# EAGLE design ZeroGecko110BreakoutV1.1 (EAGLE 6.5.0)
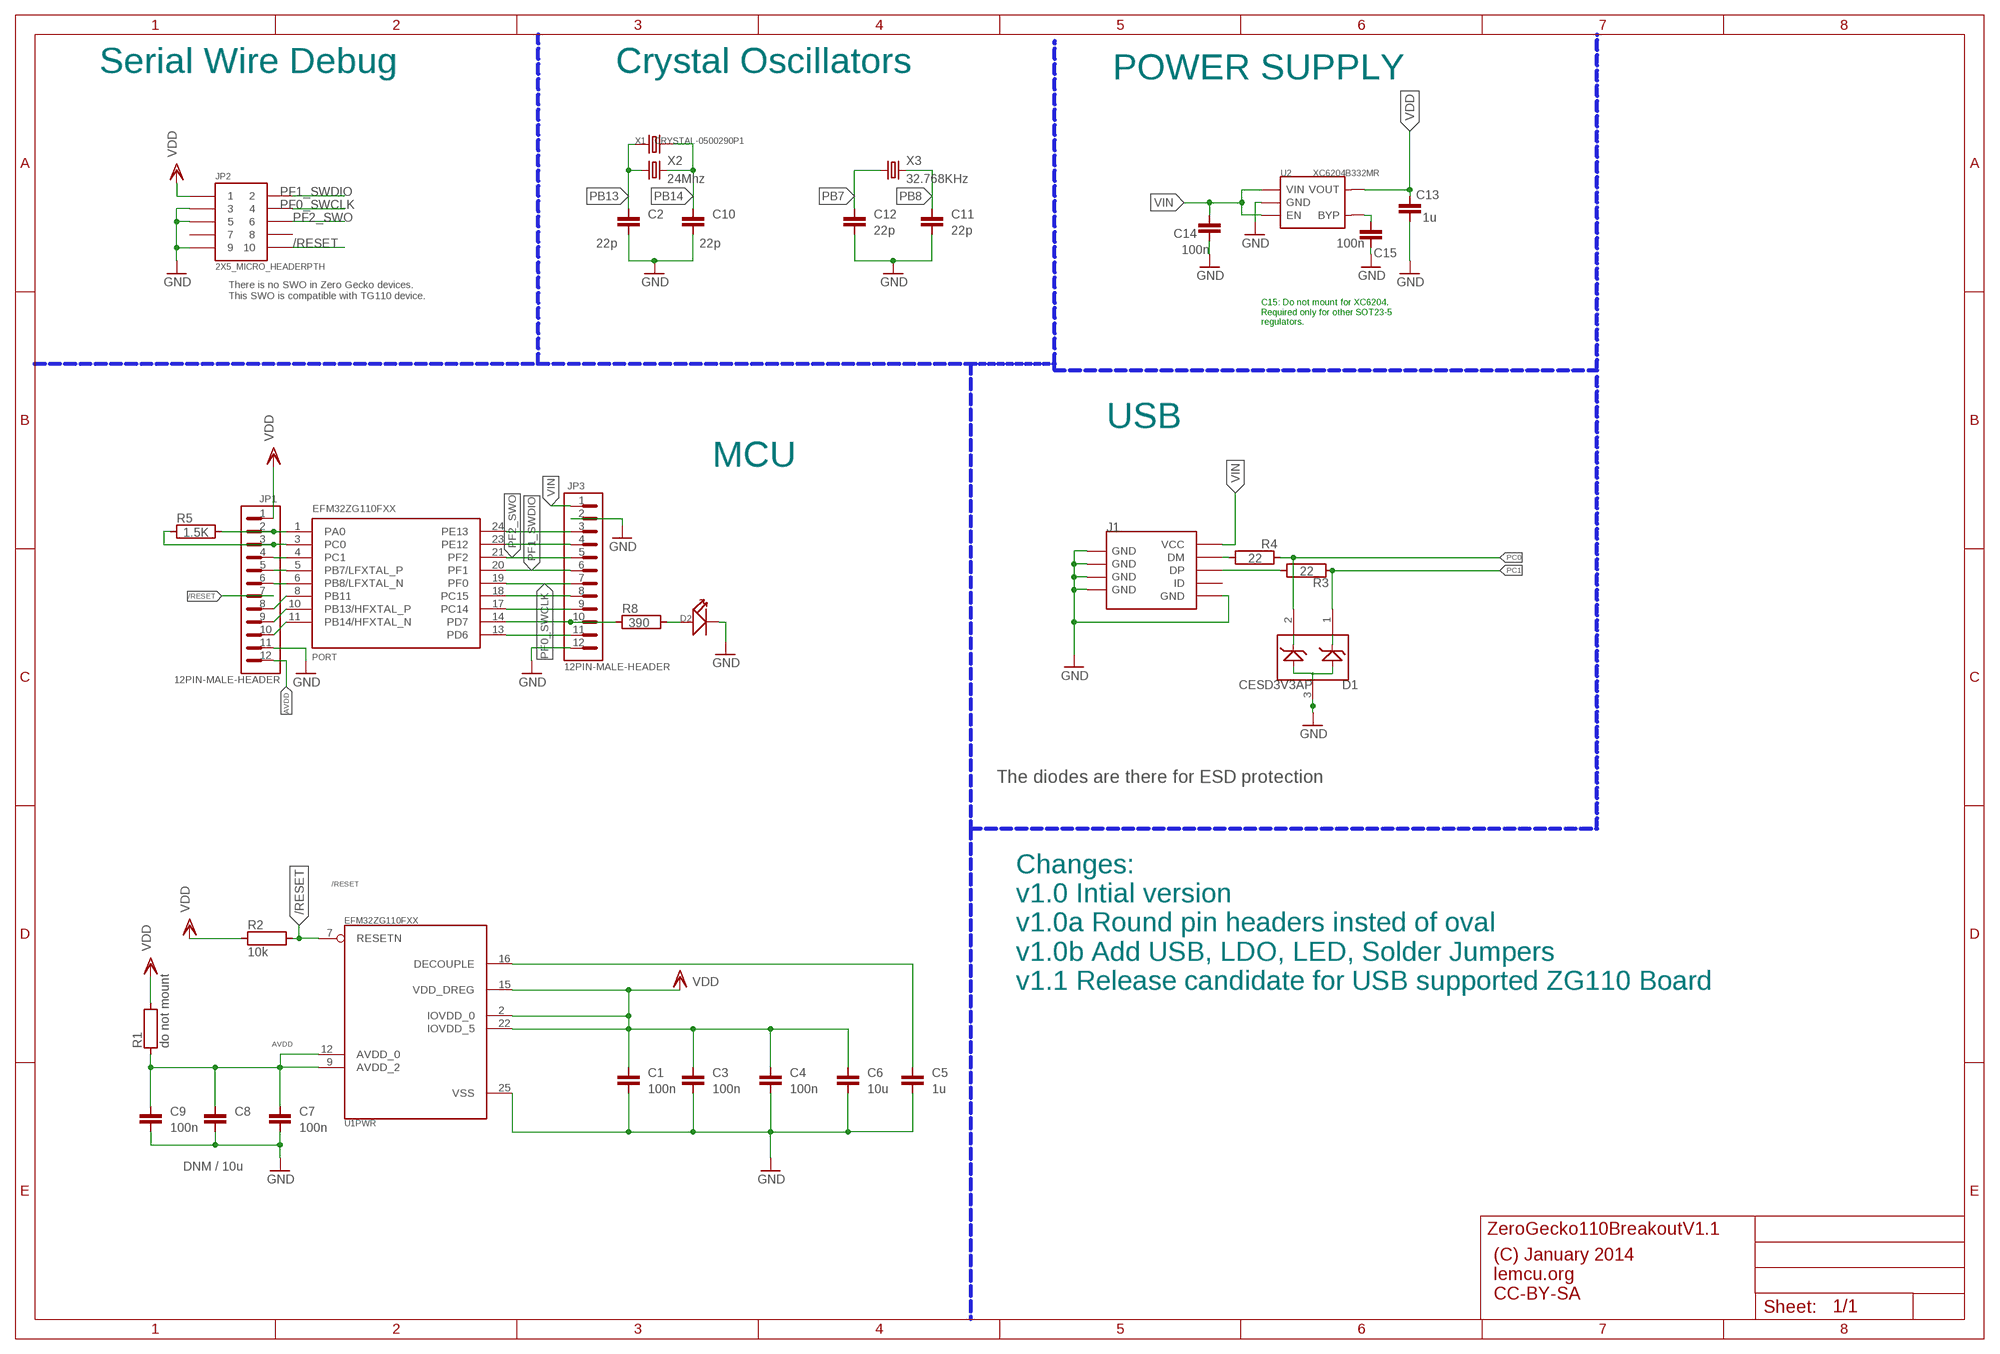
[diagram p0: schematic, sheet 1]

## Parts
C1  100n  C0603  [C0603]
C2  22p  C0603  [C0603]
C3  100n  C0603  [C0603]
C4  100n  C0603  [C0603]
C5  1u  C0805  [C0805]
C6  10u  C0805  [C0805]
C7  100n  C0603  [C0603]
C8  DNM / 10u  C0805  [C0805]
C9  100n  C0603  [C0603]
C10  22p  C0603  [C0603]
C11  22p  C0603  [C0603]
C12  22p  C0603  [C0603]
C13  1u  C0805  [C0805]
C14  100n  C0805  [C0805]
C15  100n  C0805  [C0805]
D1  CESD3V3AP  D-ESD-3P  [SOT23]
D2  LED  [LED0603]
J1  USB-MINIUSB-5P-MICRO  [MICRO-USB]
JP1  12PIN-MALE-HEADER  [12P-2.54MM]
JP2  2X5_MICRO_HEADERPTH  [2X5_1.27MM_PTH]
JP3  12PIN-MALE-HEADER  [12P-2.54MM]
R1  do not mount  R0805  [R0805]
R2  10k  R0603  [R0603]
R3  22  R0603  [R0603]
R4  22  R0603  [R0603]
R5  1.5K  R0603  [R0603]
R8  390  R0603  [R0603]
U1  EFM32ZG110FXX  [QFN24]
U2  XC6204B332MR  [SOT23-5]
X1  CRYSTAL-0500290P1  [2P-SMD-5.0X3.2]
X2  24Mhz  CRYSTALHC49U-V  [HC49U-V]
X3  32.768KHz  CRYSTALTC26V  [TC26V]

## Nets
/RESET: JP1.7 JP2.10 R2.2 U1.7(PWR:RESETN)
AVDD: C7.2 C8.2 C9.2 JP1.12 R1.1 U1.9(PWR:AVDD_2) U1.12(PWR:AVDD_0)
GND: C1.1 C2.1 C3.1 C4.1 C5.1 C6.1 C7.1 C8.1 C9.1 C10.1 C11.1 C12.1 C13.1 C14.1 C15.1 D1.3 D2.- J1.5(GND) J1.S1(GND) J1.S2(GND) J1.S3(GND) J1.S4(GND) J1.S5(GND) J1.S6(GND) JP1.11 JP2.3 JP2.5 JP2.9 JP3.2 JP3.12 U1.25(PWR:VSS) U2.2(GND)
N$1: J1.2(DM) R4.1
N$2: J1.3(DP) R3.1
N$3: D2.+ R8.2
N$4: C15.2 U2.4(BYP)
N$24: C5.2 U1.16(PWR:DECOUPLE)
PA0: JP1.2 R5.2 U1.1(A:PA0)
PB7: C12.2 JP1.5 U1.5(A:PB7/LFXTAL_P) X3.1
PB8: C11.2 JP1.6 U1.6(A:PB8/LFXTAL_N) X3.2
PB11: JP1.8 U1.8(A:PB11)
PB13: C2.2 JP1.9 U1.10(A:PB13/HFXTAL_P) X1.1 X2.1
PB14: C10.2 JP1.10 U1.11(A:PB14/HFXTAL_N) X1.2 X2.2
PC0: D1.2 JP1.3 R4.2 R5.1 U1.3(A:PC0)
PC1: D1.1 JP1.4 R3.2 U1.4(A:PC1)
PC14: JP3.9 U1.17(A:PC14)
PC15: JP3.8 U1.18(A:PC15)
PD6: JP3.11 U1.13(A:PD6)
PD7: JP3.10 R8.1 U1.14(A:PD7)
PE12: JP3.4 U1.23(A:PE12)
PE13: JP3.3 U1.24(A:PE13)
PF0_SWCLK: JP2.4 JP3.7 U1.19(A:PF0)
PF1_SWDIO: JP2.2 JP3.6 U1.20(A:PF1)
PF2_SWO: JP2.6 JP3.5 U1.21(A:PF2)
VDD: C1.2 C3.2 C4.2 C6.2 C13.2 JP1.1 JP2.1 R1.2 R2.1 U1.2(PWR:IOVDD_0) U1.15(PWR:VDD_DREG) U1.22(PWR:IOVDD_5) U2.5(VOUT)
VIN: C14.2 J1.1(VCC) JP3.1 U2.1(VIN) U2.3(EN)
Unconnected: J1.4(ID) JP2.7 JP2.8

## Notes on the sheet
- Serial Wire Debug | Crystal Oscillators | POWER SUPPLY
- There is no SWO in Zero Gecko devices.
  This SWO is compatible with TG110 device.
- C15: Do not mount for XC6204.
  Required only for other SOT23-5
  regulators.
- USB
- MCU
- The diodes are there for ESD protection
- Changes:
  v1.0 Intial version
  v1.0a Round pin headers insted of oval
  v1.0b Add USB, LDO, LED, Solder Jumpers
  v1.1 Release candidate for USB supported ZG110 Board
- (C) January 2014
  lemcu.org
  CC-BY-SA

## Library data of the parts
C1-C15 = klib:C
D1 = Discrete:D-ESD-3P
D2 = OPL Eagle Library:LED*: LED
J1 = Connector :USB-MINIUSB-5P
JP1 JP3 = lemcu_org_connector:12PIN-MALE-HEADER
JP2 = lemcu_org_micro_pin_headers:2X5_MICRO_HEADER: 2x5 1.27mm pitch micro header * 2013 (c) http://lemcu.org * Licensed under CC-BY-SA or CC0
R1-R5 R8 = klib:R
U1 = ZeroGecko:EFM32ZG110FXX: EFM32ZG110FXX Zero Microcontroller in 5mm x 5mm QFN24 package
U2 = OPL Eagle Library:XC6204: The XC6204 series are highly precise, low noise, positive voltage LDO regulators manufactured using CMOS processes
X1 = OPL Eagle Library:CRYSTAL*
X2 X3 = crystal:CRYSTAL: CRYSTAL

## Board
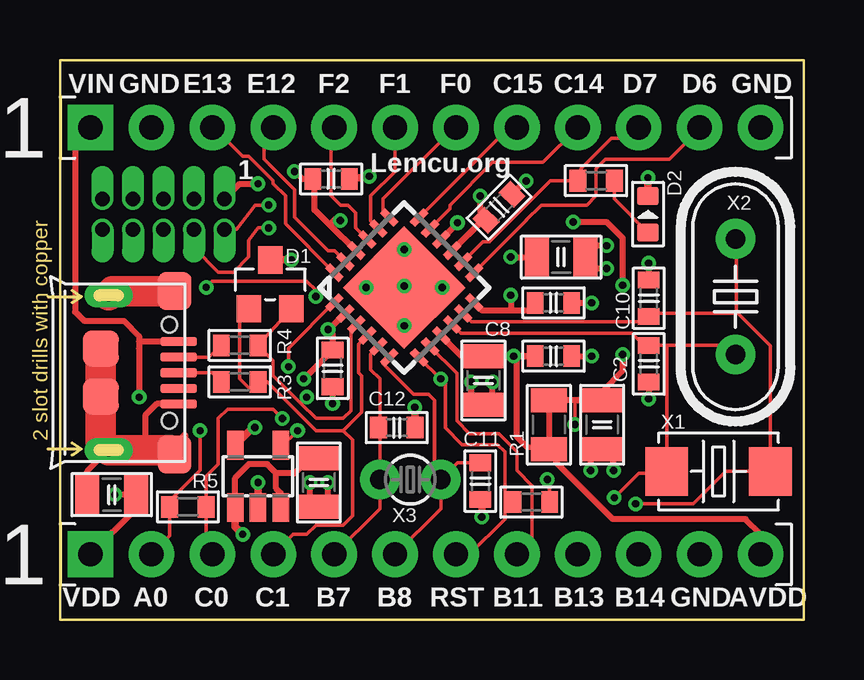
[diagram p1: board, top side]
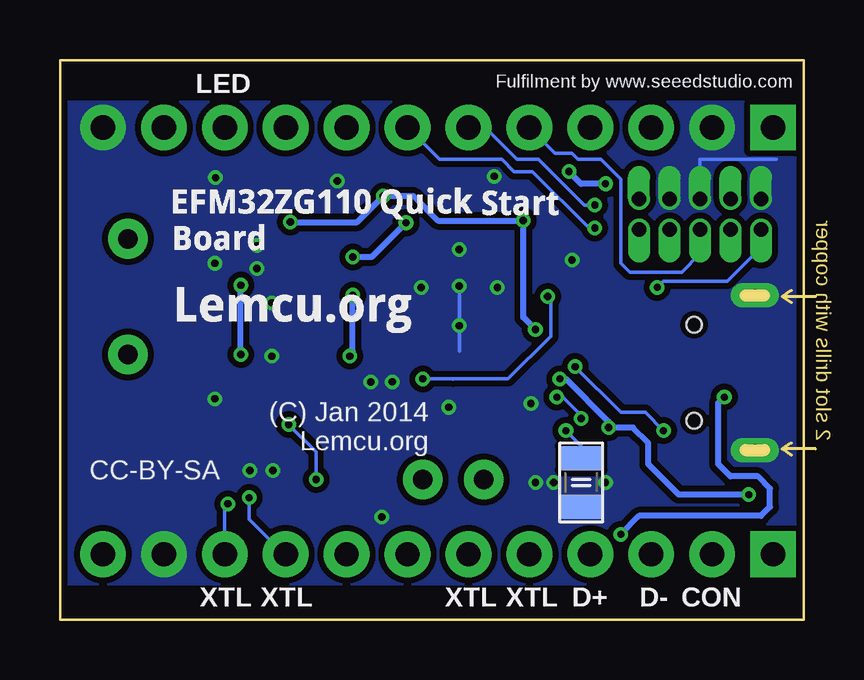
[diagram p2: board, bottom side, seen from below]

Size 31 x 23.32 mm. Coordinates in mm from the lower left corner, seen from the top.
Outline: 0,0 0,23.32 31,23.32 31,0 0,0
Copper layers (1*16): Top 0.035mm / dielectric 0.2mm / Bottom 0.035mm
Design rules: minimum track width 0.149859375mm, minimum drill 12mil, track to track 6mil, track to pad 6mil, pad to pad 6mil, via to via 6mil, smd to smd 0mil, copper to edge 10mil, drill to drill 10mil, minimum pad ring 6mil, minimum via ring 6mil, stop-mask expansion 2mil, vias tented up to drill 25mil, thermal gap 10mil

### Footprints (pad centres in the part's own frame; a part is rotated, then mirrored left to right if it is on the bottom)
C0603 = smd 0.7 x 0.9: 1 -0.762,0; 2 0.762,0
C0805 = smd 1 x 1.7: 1 -1.016,0; 2 1.016,0
SOT23 = smd 1.016 x 1.143: 1 -0.889,-1.016; 2 0.889,-1.016; 3 0,1.016
LED0603 = smd 0.762 x 0.889: + -0.762,0; - 0.762,0
MICRO-USB = smd 0.381 x 1.524: 1 -1.3,-0.25; 2 -0.65,-0.25; 3 0,-0.25; 4 0.65,-0.25; 5 1.3,-0.25 | smd 1.6 x 1.397: S1 -3.4,-0.427; S6 3.4,-0.427 | drill 0.508 pad 1.016 long: S2 -3.226,-3.175; S5 3.226,-3.175 | smd 1.5 x 1.5: S3 -1,-3.5; S4 1,-3.5 | hole 0.635: -2,-0.65; 2,-0.65
12P-2.54MM = drill 1.016 pad 1.905 square: 1 -13.97,0 | drill 1.016 pad 1.905: 2 -11.43,0; 3 -8.89,0; 4 -6.35,0; 5 -3.81,0; 6 -1.27,0; 7 1.27,0; 8 3.81,0; 9 6.35,0; 10 8.89,0; 11 11.43,0; 12 13.97,0
2X5_1.27MM_PTH = drill 0.61 offset: 1 -2.54,-0.635; 2 -2.54,0.635; 3 -1.27,-0.635; 4 -1.27,0.635; 5 0,-0.635; 6 0,0.635; 7 1.27,-0.635; 8 1.27,0.635; 9 2.54,-0.635; 10 2.54,0.635
R0805 = smd 1 x 1.5: 1 -1.016,0; 2 1.016,0
R0603 = smd 0.7 x 0.9: 1 -0.762,0; 2 0.762,0
QFN24 = smd 0.8 x 0.3: 1 -2.5,1.625; 2 -2.5,0.975; 3 -2.5,0.325; 4 -2.5,-0.325; 5 -2.5,-0.975; 6 -2.5,-1.625; 13 2.5,-1.625; 14 2.5,-0.975; 15 2.5,-0.325; 16 2.5,0.325; 17 2.5,0.975; 18 2.5,1.625 | smd 0.3 x 0.8: 7 -1.625,-2.5; 8 -0.975,-2.5; 9 -0.325,-2.5; 10 0.325,-2.5; 11 0.975,-2.5; 12 1.625,-2.5; 19 1.625,2.5; 20 0.975,2.5; 21 0.325,2.5; 22 -0.325,2.5; 23 -0.975,2.5; 24 -1.625,2.5 | smd 3.6 x 3.6: 25 0,0
SOT23-5 = smd 0.69 x 1.2: 1 -0.95,-1.3; 2 0,-1.3; 3 0.95,-1.3; 4 0.95,1.3; 5 -0.95,1.3
2P-SMD-5.0X3.2 = smd 1.778 x 2.032: 1 -2.159,0; 2 2.159,0
HC49U-V = drill 0.813 pad 1.651: 1 -2.413,0; 2 2.413,0
TC26V = drill 0.813 pad 1.651: 1 -1.27,0; 2 1.27,0

### Placement (x,y rotation side)
C1  11.37,10.47 90 top
C2  24.54,10.66 90 top
C3  18.31,17.18 225 top
C4  11.3,18.36 180 top
C5  20.89,15.11 180 top
C6  22.61,8.12 90 top
C7  20.57,13.2 180 top
C8  17.65,9.96 90 top
C9  20.57,10.98 180 top
C10  24.54,13.39 270 top
C11  17.53,5.77 90 top
C12  14.04,8 180 top
C13  2.16,5.21 0 top
C14  10.79,5.71 90 top
C15  9.27,5.71 90 bottom
D1  8.76,13.97 0 top
D2  24.51,16.89 90 top
J1  5.21,10.29 270 top
JP1  15.24,2.72 0 top
JP2  4.32,16.89 180 top
JP3  15.24,20.5 0 top
R1  20.38,8.12 90 top
R2  19.65,4.9 180 top
R3  7.49,9.91 0 top
R4  7.49,11.43 0 top
R5  5.33,4.7 180 top
R8  22.35,18.29 0 top
U1  14.35,13.84 45 top
U2  8.26,5.97 0 top
X1  27.46,6.17 0 top
X2  28.16,13.45 90 bottom
X3  14.61,5.83 0 top

### Tracks (layer width: path | path; a pad name or v marks a point on that pad's centre or on a via)
/RESET  (via drill 0.3)
  Top 0.155: JP1.7 17.07,2.72 18.54,4.19 18.54,4.55 | 18.54,4.55 18.54,6.99 18.23,7.29 16.76,7.29 16.07,7.99 16.07,9.82 15.88,10.01 v15.88,10.03 15.86,10.03 U1.7 | 18.54,4.55 R2.2 | v6.1,13.84 6.35,14.1 10.29,14.1 10.67,13.72 v10.67,13.46
  Bottom 0.155: JP2.10 1.78,15.49 3.17,14.1 5.84,14.1 v6.1,13.84 | 14.61,10.03 12.32,10.03 10.54,11.81 10.54,13.34 v10.67,13.46 | 14.61,10.03 14.62,10.02 | v15.88,10.03 14.61,10.03
AVDD  (via drill 0.3)
  Top 0.254: JP1.12 29.21,3.55 28.57,4.18 23.05,4.18 20.7,6.53 20.7,6.79 R1.1 20.7,7.1 20.7,7.17 20.07,7.17 19.49,7.18 19.05,7.62 19.05,10.98 C9.2 v18.92,10.98 arc90 18.67,10.98 C8.2 16.75,10.98 U1.9 | U1.12 17.6,12.88 18.8,12.88 | 18.8,12.88 19.62,12.88 arc90 C7.2 | v18.8,13.52 18.8,12.88
  Bottom 0.254: v18.92,10.98 18.8,11.18 v18.8,13.52
GND  (via drill 0.3)
  Top 0.155: U1.25 v15.94,13.84
  Top 0.254: 22.8,15.61 v22.8,15.58 22.04,15.58 C5.1 | v22.8,14.63 21.97,14.63 | v23.08,6.21 23.08,6.85 22.61,6.85 | v22.13,6.21 22.13,6.85 22.61,6.85 | 22.61,6.85 C6.1 | C9.1 v22.16,10.98 | C7.1 v22.16,13.2 | C1.1 v11.37,9.01 | 17.49,4.79 C11.1 | C10.1 v24.54,14.85 | C2.1 v24.54,9.2 | C3.1 19.41,18.28 v19.43,18.28 | C13.1 1.14,6.17 J1.S5 | 5.21,8.99 4.04,8.99 3.56,8.51 3.56,7.06 | v18.04,9.91 v18.03,9.91 18.03,9.27 17.14,9.27 v17.14,9.91 17.14,8.95 C8.1 | v10.41,5.71 10.41,4.7 C14.1 11.18,4.7 v11.18,5.71
  Top 0.305: v17.59,4.28 17.59,5.01 C11.1 | C12.1 v14.8,8.84 v14.8,8.85 | D2.- v24.51,18.41 | U2.2 v8.26,5.71 | C14.1 10.92,4.83 | J1.S1 5.32,14.22 | 4.61,7.06 5.21,7.66 | 5.21,8.99 J1.5 | D1.3 v9.65,14.99 | v12.89,18.47 12.58,18.41 12.06,18.41 12.08,18.34 C4.1
  Top 1.27: J1.S6 4.61,7.06 3.56,7.06 J1.S5 1.71,7.39 J1.S4 J1.S3 | J1.S2 2.21,13.69 J1.S1
  Bottom 0.155: JP2.5 4.32,19.18 1.14,19.18 | v14.35,13.9 14.35,11.18
  other vias: 14.35,15.42 14.35,12.25 12.76,13.84
  pour Bottom (isolate 0.25, no thermals): 0,21.57 30.96,21.57 30.96,1.5 0,1.5
N$1
  Top 0.155: J1.2 6.21,10.94 R4.1
N$2
  Top 0.155: J1.3 6.35,10.29 R3.1
N$3
  Top 0.155: R8.2 23.11,17.53 D2.+
N$4  (via drill 0.3)
  Top 0.155: U2.4 9.21,7.17 v9.91,7.87
  Bottom 0.155: C15.2 9.27,7.24 v9.91,7.87
N$24  (via drill 0.3)
  Top 0.155: 16.57,16.52 v16.57,16.53
  Top 0.254: U1.16 16.57,16.52 | v18.8,15.11 C5.2
  Bottom 0.254: v16.57,16.53 18,15.11 v18.8,15.11
PA0  (via drill 0.3)
  Top 0.155: JP1.2 4.57,3.48 R5.2 4.57,4.95 5.84,6.22 v5.84,7.87 | U1.1 9.53,11.31 v9.53,10.54
  Bottom 0.155: v9.53,10.54 7.62,8.64 6.6,8.64 v5.84,7.87
PB7
  Top 0.155: U1.5 12.95,11.06 12.95,10.41 13.34,10.03 13.34,8.06 C12.2 | JP1.5 13.34,4.63 X3.1 13.34,7.95 C12.2 | C12.2 13.28,8.07
PB8
  Top 0.155: JP1.6 15.88,4.63 X3.2 | C11.2 16.57,6.53 X3.2 | U1.6 13.71,10.92 13.46,10.67 14.73,9.4 15.37,9.4 15.62,9.14 15.62,6.09 X3.2
PB11
  Top 0.155: U1.8 16.54,10.27 16.54,8.28 17.08,7.74 18.3,7.74 19.05,6.99 19.05,6.22 19.68,5.59 19.68,3.36 JP1.8
PB13  (via drill 0.3)
  Top 0.155: U1.10 16.72,11.93 23.84,11.93 24.32,11.45 C2.2 25.27,11.42 | 25.27,11.42 27.65,11.42 X2.1 | 25.27,11.42 25.3,11.4 X1.1 25.22,6.1 24.13,6.1 v23.11,5.08
  Bottom 0.155: v23.11,5.08 23.11,4.19 21.59,2.67 JP1.9
PB14  (via drill 0.3)
  Top 0.155: U1.11 17.16,12.41 24.48,12.41 C10.2 24.78,12.76 28.12,12.76 28.19,12.83 | 28.19,12.83 29.62,11.4 X1.2 27.77,6.17 26.42,4.83 v24,4.83 | 28.19,12.83 28.19,15.58 X2.2
  Bottom 0.155: v24,4.83 24.13,4.7 JP1.10
PC0  (via drill 0.3)
  Top 0.155: U1.3 12.13,11.95 12.13,8.7 11.81,8.38 10.67,8.38 10.03,9.02 | JP1.3 6.1,2.98 R5.1 6.1,5.97 6.6,6.48 6.6,8.38 6.99,8.76 8.89,8.76 v9.27,8.38 | D1.2 R4.2 8.89,10.79 8.89,10.16 10.03,9.02 | v10.29,9.27 10.03,9.02
  Bottom 0.155: v9.27,8.38 9.27,8.51 10.03,9.27 v10.29,9.27
PC1
  Top 0.155: U1.4 12.45,11.47 12.45,10.29 12.57,10.16 12.57,8.64 11.81,7.87 | D1.1 7.49,12.57 7.49,10.03 8,9.53 R3.2 8.64,9.91 10.67,7.87 11.81,7.87 | JP1.4 9.72,3.56 10.29,3.56 10.67,3.94 11.81,3.94 12.19,4.32 12.19,7.49 11.81,7.87
PC14
  Top 0.155: JP3.9 20.14,19.05 18.03,19.05 16.26,17.27 16.26,17.12 U1.17
PC15
  Top 0.155: U1.18 18.72,20.5 JP3.8
PD6
  Top 0.155: U1.13 19.45,16.64 19.43,16.64 20.07,17.27 21.97,17.27 22.35,17.65 22.35,18.8 22.73,19.18 25.4,19.18 26.67,20.45 JP3.11
PD7
  Top 0.155: JP3.10 23.69,20.07 22.99,20.07 21.72,18.8 R8.1 20.45,18.29 17.91,15.75 17.64,15.75 U1.14
PE12
  Top 0.155: JP3.4 8.51,20.12 8.51,19.18 9.78,17.91 9.78,16.76 11.18,15.37 11.44,15.37 U1.23
PE13
  Top 0.155: U1.24 9.4,16.49 9.4,17.65 8.89,18.16 8.89,18.29 7.87,19.3 7.62,19.3 6.42,20.5 JP3.3
PF0_SWCLK  (via drill 0.3)
  Top 0.155: JP2.4 5.59,15.49 6.6,14.48 7.24,14.48 7.87,15.11 7.87,15.81 8.26,16.32 v8.7,16.32 | U1.19 13.46,17.02 13.46,17.53 16.44,20.5 JP3.7
  Bottom 0.155: v8.7,16.32 8.95,16.32 11.3,18.67 12.06,18.67 12.57,19.18 15.18,19.18 JP3.7
PF1_SWDIO  (via drill 0.3)
  Top 0.155: JP2.2 7.37,16.26 8.13,17.27 v8.7,17.27 | U1.20 12.95,16.61 12.95,17.65 13.97,18.67 JP3.6
  Bottom 0.155: v8.7,17.27 9.14,17.27 11.05,19.18 11.94,19.18 13.26,20.5 JP3.6
PF2_SWO
  Top 0.155: JP3.5 11.3,20.38 11.3,17.66 11.69,17.27 12,17.27 12.32,16.95 12.32,16.32 U1.21
  Bottom 0.155: JP2.6 4.32,15.24 5.08,14.48 7.24,14.48 7.62,14.86 7.62,18.34 8.45,19.18 9.4,19.18 9.65,19.43 10.36,19.43 JP3.5
VDD  (via drill 0.3)
  Top 0.155: 17.62,16.64 C3.2 | R2.1 20.41,5.75 v20.32,5.84 | v21.46,8.13 21.46,9.01 21.59,9.14
  Top 0.254: 17.62,16.64 U1.15 17.67,16.69 17.84,16.69 17.53,17.01 v17.53,17.64 | U1.2 11.23,12.09 v11.18,12.09 11.37,11.9 C1.2 v10.17,10.03 v10.16,10.03 | 22.61,9.07 C6.2 | C6.2 22.61,9.53 23.46,10.38 v23.46,11.04 | v23.46,13.93 23.46,15.9 22.8,16.57 v21.4,16.57 | C6.2 21.59,9.14 R1.2 20.38,6.99 | JP1.1 3.17,4.63 C13.2 v2.29,5.21 | 10.6,18.3 10.6,17.07 11.24,16.45 | JP2.1 7.49,18.16 v8.26,18.16 | v9.78,18.67 10.09,18.36 C4.2 | U1.22 11.24,16.45 | v11.68,16.63 11.49,16.7 11.24,16.45
  Top 0.305: v8.13,8 8.04,8 U2.5 | 10.6,18.3 C4.2
  Bottom 0.155: v20.32,5.84 20.32,6.99 v21.46,8.13
  Bottom 0.254: v11.18,12.09 11.68,12.6 v11.68,16.63 15.24,16.63 16.26,17.65 17.53,17.65 v17.53,17.64 18.61,16.57 v21.4,16.57 | v23.46,11.04 v23.46,13.93 | v2.29,5.21 5.21,5.21 6.48,6.48 6.48,7.37 7.11,8 v8.13,8 | 8.13,8.13 8.13,8.26 9.91,10.03 v10.16,10.03 | v8.26,18.16 9.27,18.16 v9.78,18.67
  Bottom 0.305: v8.13,8 8.13,8.13
VIN  (via drill 0.3)
  Top 0.254: U2.1 7.3,5.91 7.87,6.48 8.64,6.48 9.02,6.1 | U2.3 9.21,5.27 9.02,5.46 9.02,6.1 | 3.3,11.59 3.3,11.81 2.67,12.45 1.02,12.45 0.64,12.83 0.64,19.87 JP3.1 | v3.3,9.27 3.3,11.3 3.3,11.59 | 10.41,6.73 9.78,6.1 9.02,6.1 | J1.1 3.3,11.59
  Top 0.305: v7.62,3.56 7.3,3.87 U2.1 | C14.2 10.41,6.73
  Bottom 0.254: v7.62,3.56 6.86,4.32 1.78,4.32 1.4,4.7 1.4,5.46 1.91,5.97 3.05,5.97 3.56,6.48 3.56,9.02 v3.3,9.27

### Text on the board
tPlace: VIN | GND | E13 | E12 | F2 | F1 | F0 | C15 | C14 | D7 | D6 | GND | Lemcu.org | 1 | VDD | A0 | C0 | C1 | B7 | B8 | B8 | RST | B11 | B13 | B14 | GND | AVDD
bPlace: Fulfilment by www.seeedstudio.com | LED | (C) Jan 2014 / Lemcu.org | CC-BY-SA | CON | D- | D+ | XTL | XTL | XTL | XTL